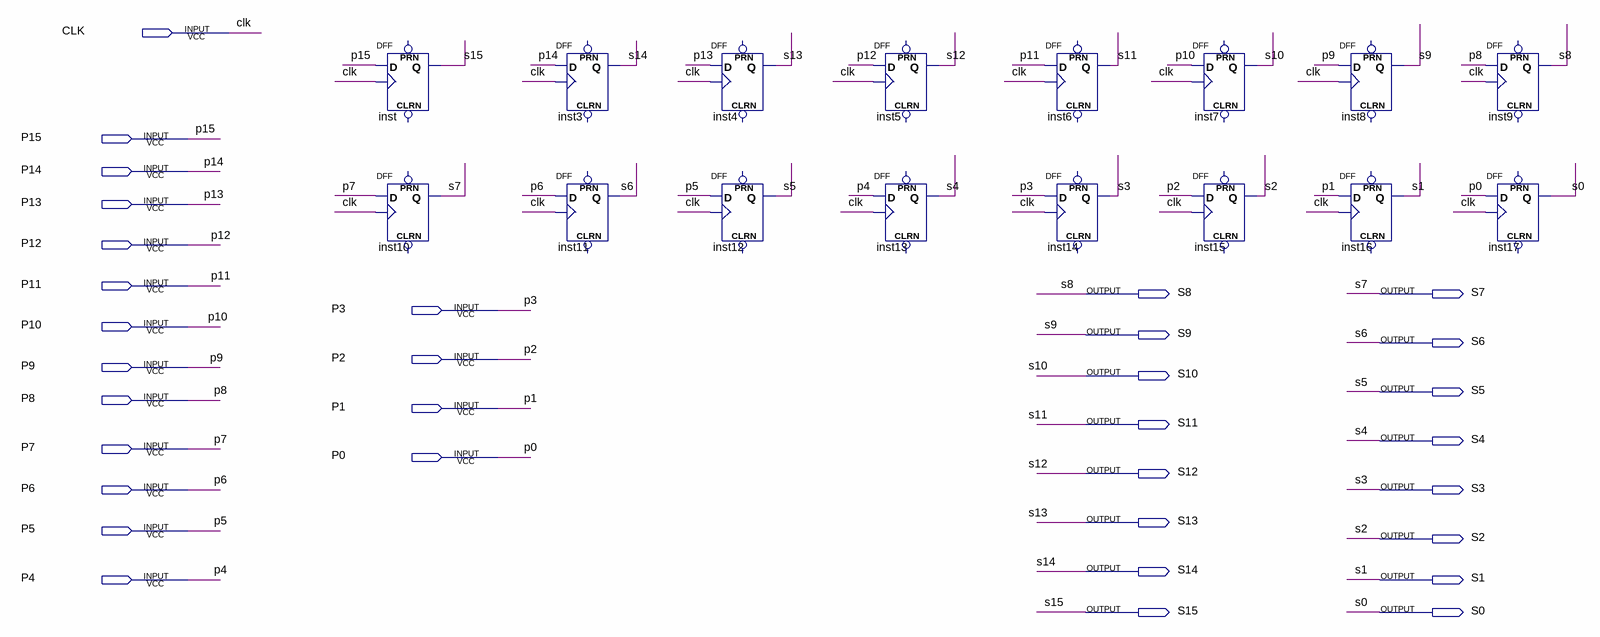
[diagram p0: schematic sheet]
// Quartus schematic Trabajo_practico_03_Entrada_in.bdf as structural Verilog: 16 symbols, 33 pins
module Trabajo_practico_03_Entrada_in (
  input  CLK,
  input  P15,
  input  P14,
  input  P13,
  input  P12,
  input  P11,
  input  P3,
  input  P10,
  input  P2,
  input  P9,
  input  P8,
  input  P1,
  input  P7,
  input  P0,
  input  P6,
  input  P5,
  input  P4,
  output S8,
  output S7,
  output S9,
  output S6,
  output S10,
  output S5,
  output S11,
  output S4,
  output S12,
  output S3,
  output S13,
  output S2,
  output S14,
  output S1,
  output S15,
  output S0
);

  DFF inst (.CLK(CLK), .D(P15), .Q(S15));  // open: CLRN, PRN
  DFF inst10 (.CLK(CLK), .D(P7), .Q(S7));  // open: CLRN, PRN
  DFF inst3 (.CLK(CLK), .D(P14), .Q(S14));  // open: CLRN, PRN
  DFF inst11 (.CLK(CLK), .D(P6), .Q(S6));  // open: CLRN, PRN
  DFF inst4 (.CLK(CLK), .D(P13), .Q(S13));  // open: CLRN, PRN
  DFF inst12 (.CLK(CLK), .D(P5), .Q(S5));  // open: CLRN, PRN
  DFF inst5 (.CLK(CLK), .D(P12), .Q(S12));  // open: CLRN, PRN
  DFF inst13 (.CLK(CLK), .D(P4), .Q(S4));  // open: CLRN, PRN
  DFF inst6 (.CLK(CLK), .D(P11), .Q(S11));  // open: CLRN, PRN
  DFF inst14 (.CLK(CLK), .D(P3), .Q(S3));  // open: CLRN, PRN
  DFF inst7 (.CLK(CLK), .D(P10), .Q(S10));  // open: CLRN, PRN
  DFF inst15 (.CLK(CLK), .D(P2), .Q(S2));  // open: CLRN, PRN
  DFF inst8 (.CLK(CLK), .D(P9), .Q(S9));  // open: CLRN, PRN
  DFF inst16 (.CLK(CLK), .D(P1), .Q(S1));  // open: CLRN, PRN
  DFF inst9 (.CLK(CLK), .D(P8), .Q(S8));  // open: CLRN, PRN
  DFF inst17 (.CLK(CLK), .D(P0), .Q(S0));  // open: CLRN, PRN
endmodule
